# EAGLE design boost-highpower (EAGLE 9.6.0)
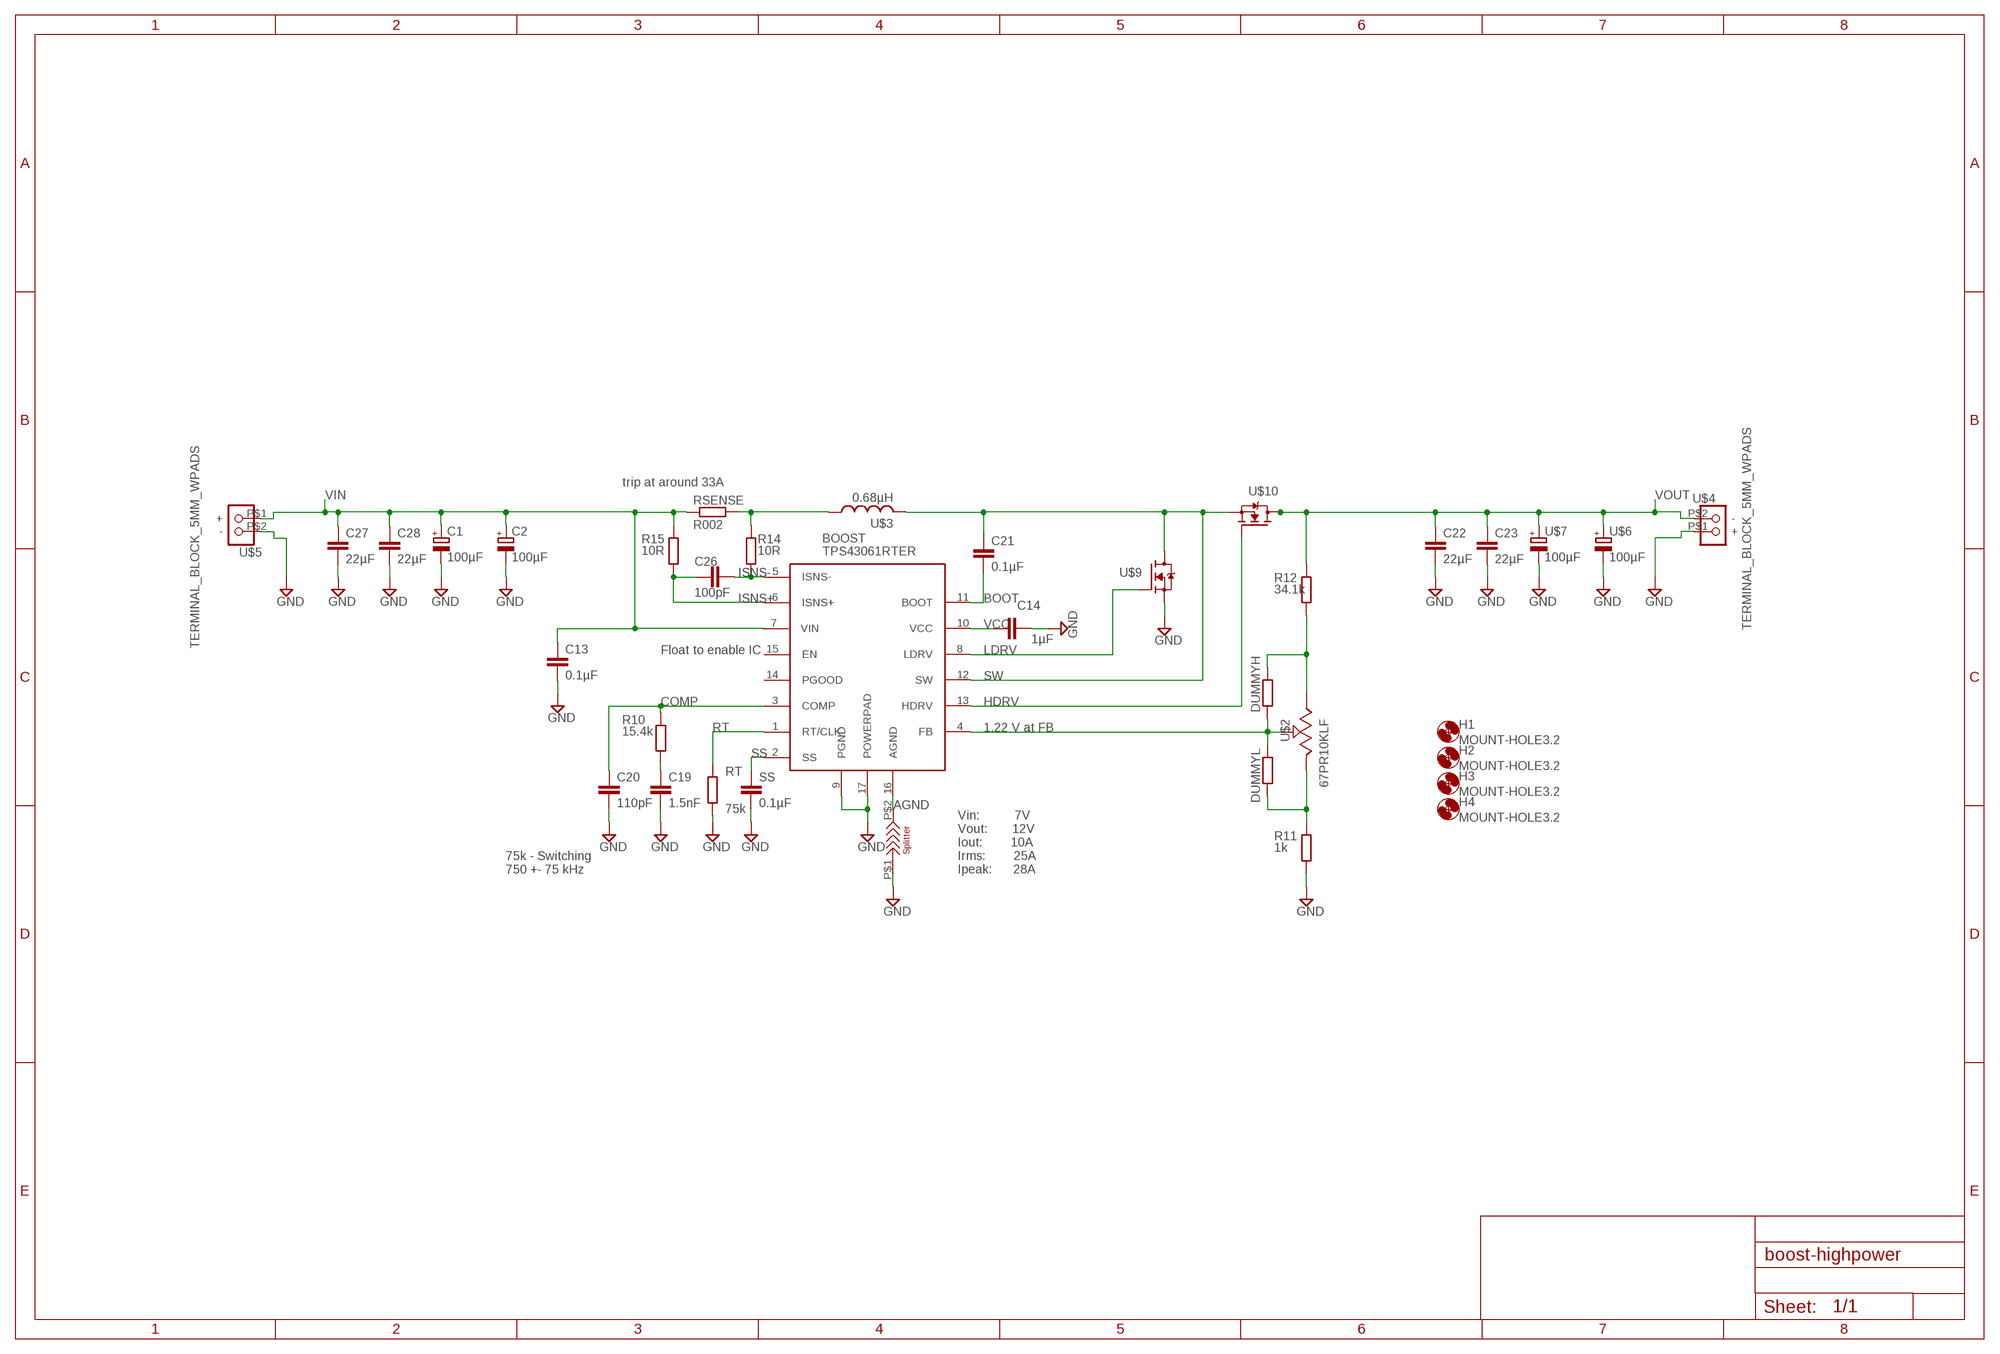
[diagram p0: schematic, sheet 1]

## Parts
BOOST  TPS43061RTER  [QFN50P300X300X80-17N]
C1  100µF  WCAP-ASLL-WE50V100µF  [CAPAE830X850N]
C2  100µF  WCAP-ASLL-WE50V100µF  [CAPAE830X850N]
C13  0.1µF  C-EUC0805  [C0805]
C14  1µF  C-EUC0603  [C0603]
C19  1.5nF  C-EUC0603  [C0603]
C20  110pF  C-EUC0603  [C0603]
C21  0.1µF  C-EUC0805  [C0805]
C22  22µF  C-EUC0805  [C0805]
C23  22µF  C-EUC0805  [C0805]
C26  100pF  C-EUC0603  [C0603]
C27  22µF  C-EUC0805  [C0805]
C28  22µF  C-EUC0805  [C0805]
DUMMYH  R-EU_R0201  [R0201]
DUMMYL  R-EU_R0201  [R0201]
H1  MOUNT-HOLE3.2  [3,2]
H2  MOUNT-HOLE3.2  [3,2]
H3  MOUNT-HOLE3.2  [3,2]
H4  MOUNT-HOLE3.2  [3,2]
R10  15.4k  R-EU_R0603  [R0603]
R11  1k  R-EU_R0603  [R0603]
R12  34.1k  R-EU_R0603  [R0603]
R14  10R  R-EU_R0603  [R0603]
R15  10R  R-EU_R0603  [R0603]
RSENSE  R002  R-EU_R2512W  [R2512W]
RT  75k  R-EU_R0603  [R0603]
SS  0.1µF  C-EUC0603  [C0603]
U$1  SPLITTER  [SPLITTER]
U$2  67PR10KLF  [67PR10KLF]
U$3  0.68µH  SRP1238A-XXXX  [INDM135125X330N]
U$4  TERMINAL_BLOCK_5MM_WPADS  [TERMINAL_5MM_WITH_SOLDERPADS]
U$5  TERMINAL_BLOCK_5MM_WPADS  [TERMINAL_5MM_WITH_SOLDERPADS]
U$6  100µF  CAP_VZH  [CAPAE1030X1000N]
U$7  100µF  CAP_VZH  [CAPAE1030X1000N]
U$9  CSD17301Q5A  [Q5A]
U$10  CSD17301Q5A  [Q5A]

## Nets
AGND: BOOST.16(AGND) U$1.P$2
BOOT: BOOST.11(BOOT) C21.2
COMP: BOOST.3(COMP) C20.1 R10.2
GND: BOOST.9(PGND) BOOST.17(POWERPAD) C1.2(-) C2.2(-) C13.2 C14.2 C19.2 C20.2 C22.2 C23.2 C27.2 C28.2 R11.1 RT.1 SS.2 U$1.P$1 U$4.P$1(+) U$5.P$2(-) U$6.2(-) U$7.2(-) U$9.1(S) U$9.2(S) U$9.3(S)
HDRV: BOOST.13(HDRV) U$10.4(G)
ISNS+: BOOST.6(ISNS+) C26.1 R15.1
ISNS-: BOOST.5(ISNS-) C26.2 R14.1
LDRV: BOOST.8(LDRV) U$9.4(G)
N$3: DUMMYH.2 R12.1 U$2.P$3
N$4: DUMMYL.1 R11.2 U$2.P$1
N$13: C19.1 R10.1
N$18: R14.2 RSENSE.2 U$3.1
N$20: BOOST.4(FB) DUMMYH.1 DUMMYL.2 U$2.P$2
RT: BOOST.1(RT/CLK) RT.2
SS: BOOST.2(SS) SS.1
SW: BOOST.12(SW) C21.1 U$3.2 U$9.5(D) U$9.6(D) U$9.7(D) U$9.8(D) U$9.9(D) U$10.1(S) U$10.2(S) U$10.3(S)
VCC: BOOST.10(VCC) C14.1
VIN: BOOST.7(VIN) C1.1(+) C2.1(+) C13.1 C27.1 C28.1 R15.2 RSENSE.1 U$5.P$1(+)
VOUT: C22.1 C23.1 R12.2 U$4.P$2(-) U$6.1(+) U$7.1(+) U$10.5(D) U$10.6(D) U$10.7(D) U$10.8(D) U$10.9(D)
Unconnected: BOOST.14(PGOOD) BOOST.15(EN)

## Notes on the sheet
- trip at around 33A
- Float to enable IC
- 1.22 V at FB
- 75k - Switching 
  750 +- 75 kHz
- Vin:          7V
  Vout:       12V
  Iout:        10A
  Irms:        25A
  Ipeak:      28A

## Library data of the parts
BOOST = PowerManagement:TPS43061RTER: Low Iq, Synchronous Boost Controller with Wide Input Voltage and 5.5V Gate Drive for Low Qg NexFETs Source: Datasheet <http://www.ti.com/lit/gpn/tps43061>; DESCRIPTION: Low Iq, Synchronous Boost Controller with Wide Input Voltage and 5.5V Gate Drive for Low Qg NexFETs; HEIGHT: 0.8mm; MANUFACTURER_NAME: Texas Instruments; MANUFACTURER_PART_NUMBER: TPS43061RTER; MOUSER_PART_NUMBER: 595-TPS43061RTER; MOUSER_PRICE-STOCK: https://www.mouser.com/Search/Refine.aspx?Keyword=595-TPS43061RTER
C1 C2 = Passive:WCAP-ASLL-WE
C13 C14 C19-C23 C26-C28 SS = rcl:C-EU: CAPACITOR, European symbol; SPICEPREFIX: C
DUMMYH DUMMYL R10-R12 R14 R15 RSENSE RT = rcl:R-EU_: RESISTOR, European symbol; SPICEPREFIX: R
H1-H4 = holes:MOUNT-HOLE: MOUNTING HOLE with drill center marker
U$1 = PowerManagement:SPLITTER
U$2 = Passive:67PR10KLF
U$3 = PowerManagement:SRP1238A-XXXX: Inductor Description: R68M: 0.68µH + 28A + 49Asat Source: Datasheet <https://www.mouser.se/datasheet/2/54/bourns_SRP1238A-1159514.pdf>
U$4 U$5 = Connectors:TERMINAL_BLOCK_5MM_WPADS
U$6 U$7 = Passive:CAP_VZH
U$9 U$10 = PowerManagement:CSD17301Q5A: CSD17301Q5A 30V N-channel 100A Mosfet Datasheet <http://www.ti.com/lit/ds/symlink/csd17301q5a.pdf> Part number Mfr:CSD17301Q5A Mouser: 595-CSD17301Q5A

## Board
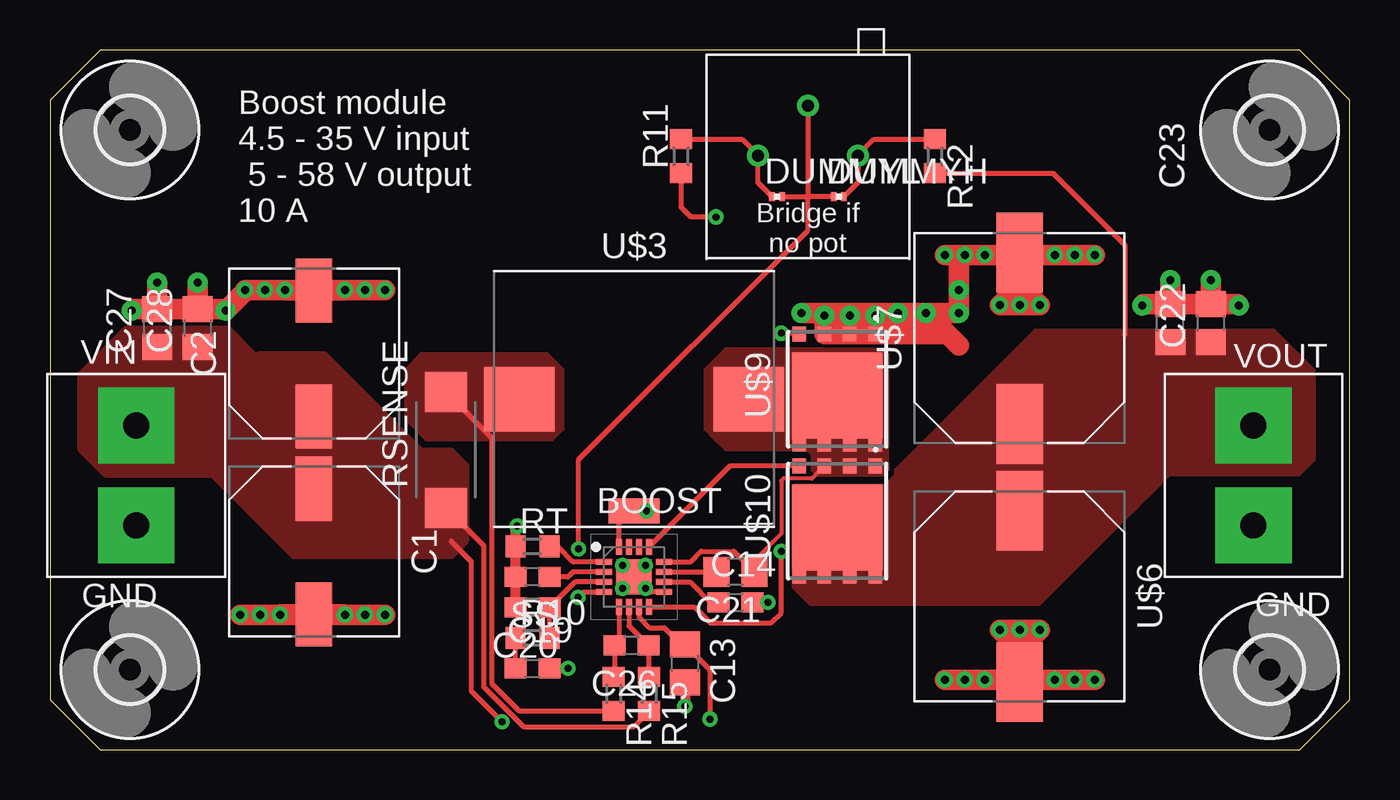
[diagram p1: board, top side]
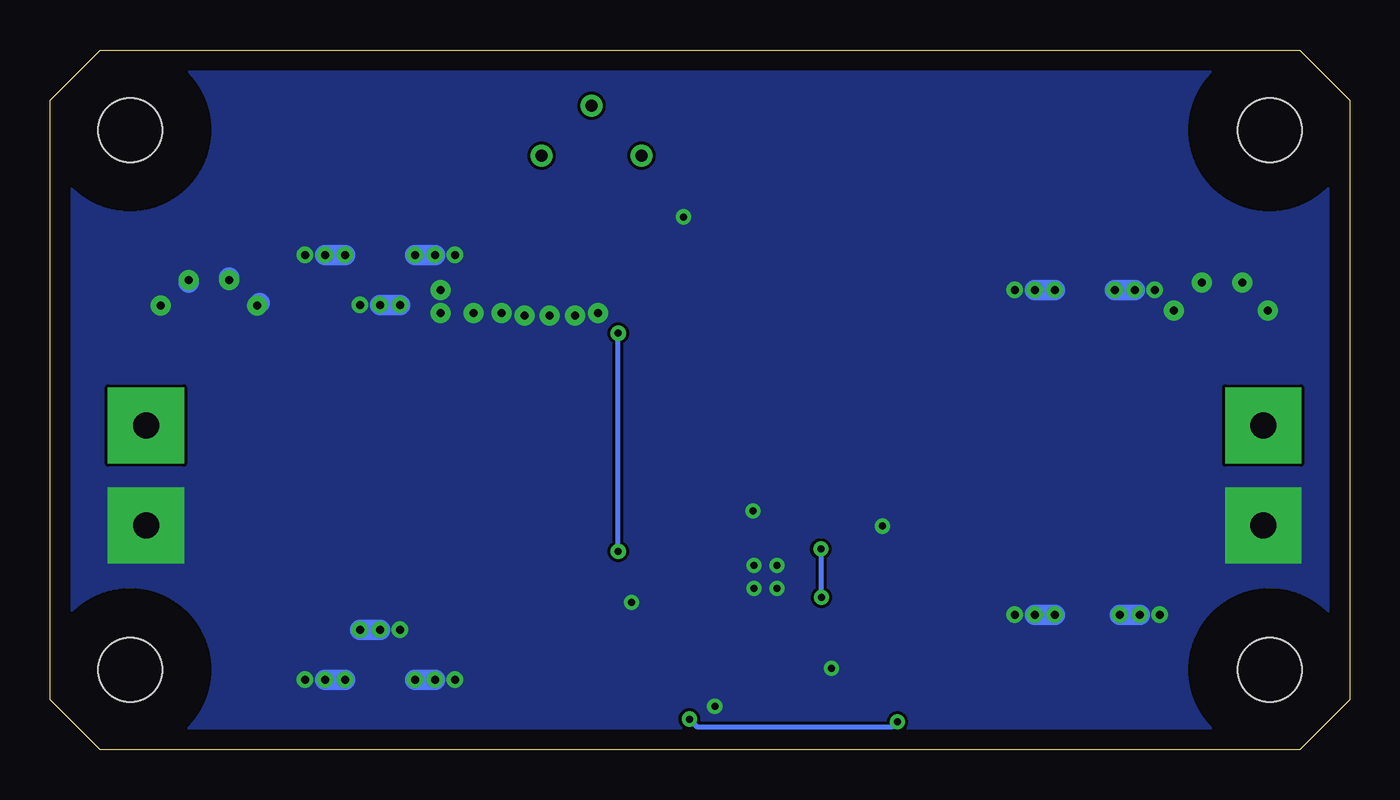
[diagram p2: board, bottom side, seen from below]

Size 65 x 35 mm. Coordinates in mm from the lower left corner, seen from the top.
Outline: 0,32.5 0,2.5 2.5,0 62.5,0 65,2.5 65,32.5 62.5,35 2.5,35 0,32.5
Copper layers (1*16): Top 0.035mm / dielectric 1.5mm / Bottom 0.035mm
Design rules "default": minimum track width 6mil, minimum drill 0.35mm, track to track 6mil, track to pad 6mil, pad to pad 6mil, via to via 6mil, smd to smd 6mil, copper to edge 40mil, drill to drill 6mil, minimum pad ring 10mil, minimum via ring 8mil, stop-mask expansion 4mil, vias tented up to drill 0mil, thermal gap 10mil

### Footprints (pad centres in the part's own frame; a part is rotated, then mirrored left to right if it is on the bottom)
QFN50P300X300X80-17N = smd 0.8 x 0.3: 1 -1.5,0.75; 2 -1.5,0.25; 3 -1.5,-0.25; 4 -1.5,-0.75; 9 1.5,-0.75; 10 1.5,-0.25; 11 1.5,0.25; 12 1.5,0.75 | smd 0.3 x 0.8: 5 -0.75,-1.5; 6 -0.25,-1.5; 7 0.25,-1.5; 8 0.75,-1.5; 13 0.75,1.5; 14 0.25,1.5; 15 -0.25,1.5; 16 -0.75,1.5 | smd 1.76 x 1.76: 17 0,0
CAPAE830X850N = smd 3.203 x 1.829: 1 -3.144,0; 2 3.144,0
C0805 = smd 1.3 x 1.5: 1 -0.95,0; 2 0.95,0
C0603 = smd 1.1 x 1: 1 -0.85,0; 2 0.85,0
R0201 = smd 0.28 x 0.43: 1 -0.255,0; 2 0.255,0
3,2 = hole 3.2: 0,0
R0603 = smd 1 x 1.1: 1 -0.85,0; 2 0.85,0
R2512W = smd 2 x 2.1: 1 -2.896,0; 2 2.896,0
SPLITTER = smd 1.27 x 1.27: P$1 0,0.635; P$2 0,-0.635
67PR10KLF = drill 0.6: P$1 2.5,-2.5; P$2 0,0; P$3 2.5,2.5
INDM135125X330N = smd 3.533 x 3.21: 1 -5.736,0; 2 5.736,0
TERMINAL_5MM_WITH_SOLDERPADS = drill 1.3 pad 3.81 square: P$1 0,2.5; P$2 0,-2.5
CAPAE1030X1000N = smd 3.991 x 2.31: 1 -4.288,0; 2 4.288,0
Q5A = smd 0.75 x 0.675: 1 2.752,-1.905; 2 2.752,-0.635; 3 2.752,0.635; 4 2.752,1.905 | smd 0.655 x 0.675: 5 -2.8,1.905; 6 -2.8,0.635; 7 -2.8,-0.635; 8 -2.8,-1.893 | smd 4.295 x 4.51: 9 -0.325,0

### Placement (x,y rotation side)
BOOST  29.21,8.64 0 top
C1  13.21,9.91 270 top
C2  13.21,19.81 90 top
C13  31.75,4.32 270 top
C14  34.29,7.37 0 top
C19  24.13,4.06 0 top
C20  24.13,7.11 180 top
C21  34.29,8.89 180 top
C22  58.07,21.33 90 top
C23  56.03,21.33 90 top
C26  29.08,5.21 180 top
C27  5.37,21.08 90 top
C28  7.4,21.08 90 top
DUMMYH  39.45,27.66 0 top
DUMMYL  36.37,27.66 0 top
H1  4,31 0 top
H2  4,4 0 top
H3  61,4 0 top
H4  61,31 0 top
R10  24.13,5.59 0 top
R11  31.56,29.68 90 top
R12  44.26,29.68 270 top
R14  28.19,2.79 270 top
R15  29.97,2.79 270 top
RSENSE  19.8,14.99 90 top
RT  24.13,10.16 0 top
SS  24.13,8.64 180 top
U$1  29.21,11.94 270 top
U$2  37.91,32.22 270 top
U$3  29.21,17.53 0 top
U$4  60.2,13.72 180 top
U$5  4.32,13.72 0 top
U$6  48.5,7.66 270 top
U$7  48.5,20.58 90 top
U$9  39.37,18.03 90 top
U$10  39.37,11.43 90 top

### Tracks (layer width: path | path; a pad name or v marks a point on that pad's centre or on a via)
AGND
  Top 0.254: BOOST.16 28.46,11.82 U$1.P$2
BOOT
  Top 0.254: BOOST.11 C21.2
COMP
  Top 0.254: BOOST.3 26.25,8.38 C20.1 R10.2
GND  (via drill 0.35 pad 0.6, 0.4, 0.4 pad 1)
  Top 0.254: BOOST.9 29.73,7.89 29.72,7.87 28.45,7.87 28.45,8.64 | 28.45,8.64 28.45,9.4 29.97,9.4 29.97,7.87 | BOOST.17 28.45,8.64 | BOOST.17 v28.64,9.21 | BOOST.17 v29.78,9.21 | BOOST.17 v29.78,8.07 | BOOST.17 v28.64,8.07 | C14.2 v35.92,7.37 | v33.31,26.65 32.06,26.65 31.56,27.15 R11.1
  Top 0.508: C20.2 SS.2 RT.1 23.28,11.09 v23.37,11.18 | C19.2 v25.91,4.06 | C13.2 v31.75,2.16
  Top 1.016: C27.2 C28.2 | C28.2 8.73,22.03 v8.79,21.97 9.75,22.93 v9.75,23 | C27.2 4.16,22.03 v4.1,21.97 | C27.2 v5.37,23.37 | C28.2 v7.4,23.37 | U$9.3 U$9.1 | U$9.3 v38.73,21.72 | 40.01,21.34 U$9.2 40.94,21.72 v41.27,21.72 | 40.01,21.34 v40.01,21.72 | U$9.1 v41.27,21.72 | v41.27,21.72 42.29,21.72 | 42.29,21.72 v42.42,21.84 43.18,21.84 | v37.59,21.84 42.16,21.84 42.29,21.72 | U$9.3 39.28,21.34 40.01,21.34 | 43.22,20.79 U$9.1 | 45.47,20.2 v43.82,21.84 | 44.63,20.79 43.69,20.79 | 43.69,20.79 43.22,20.79 | 43.22,20.79 42.67,21.34 43.18,21.84 | 43.18,21.84 v43.82,21.84 | C22.2 59.4,22.28 v59.46,22.22 | C23.2 54.7,22.28 v54.64,22.22 | C23.2 v56.03,23.49 | C22.2 v58.07,23.49 | C22.2 C23.2 | v43.82,21.84 v45.47,21.84 v45.47,22.99 45.47,24.47 v45.75,24.75 v44.75,24.75 v52.25,24.75 v51.25,24.75 | v43.82,21.84 43.69,21.71 43.69,20.79 | 48.5,26.25 U$7.2 48.5,23.25 | v51.25,3.5 v52.25,3.5 v44.75,3.5 v45.75,3.5 | 48.5,5.25 v48.5,6 v47.5,6 | v47.5,6 v49.5,6 49,5.5 49,5 48.75,5 48.5,5.25 | 48.5,5.25 U$6.2 48.5,5 v47.5,6 | 48.5,23.25 v48.5,22.25 | 48.5,23.25 v47.5,22.25 v49.5,22.25 48.5,23.25 | v11.5,6.75 11.51,6.76 C1.2 14.74,6.76 v14.75,6.75 | v10.5,6.75 v9.5,6.75 v16.75,6.75 v15.75,6.75 | v14.75,23 14.71,22.96 C2.2 11.79,22.96 v11.75,23 | v15.75,23 v16.75,23 v9.75,23 | v10.75,23 v9.75,23
  Bottom 0.254: v35.92,7.37 36.07,7.37
  Bottom 1.016: v54.64,22.22 54.51,22.34 | v56.03,23.49 56.03,23.61 | v58.07,23.49 58.07,23.36 | v50.25,24.75 v51.25,24.75 | v46.75,24.75 v45.75,24.75 | v50.25,3.5 v51.25,3.5 | v46.75,3.5 v45.75,3.5 | v48.5,6 v49.5,6 | v48.5,22.25 v47.5,22.25 | v11.5,6.75 v10.5,6.75 | v14.75,6.75 v15.75,6.75 | v14.75,23 v15.75,23 | v11.75,23 v10.75,23
  other vias: 29.84,11.94
  pour Bottom (no thermals): 64.77,36.07 -0.25,36.07 -1.52,34.8 -1.52,1.52 1.27,-1.27 63.75,-1.27 67.06,2.03 67.06,33.78
HDRV
  Top 0.254: U$10.4 34.01,14.18 BOOST.13
ISNS+
  Top 0.254: BOOST.6 28.96,6.18 C26.1 29.93,3.68 R15.1
ISNS-
  Top 0.254: BOOST.5 28.46,5.43 C26.2 28.23,3.68 R14.1
LDRV  (via drill 0.35 pad 0.6)
  Top 0.254: BOOST.8 32.23,7.14 32.61,6.76 32.61,6.75 33.03,6.33 36.06,6.33 36.58,6.85 v36.58,9.91 | v36.58,20.83 37.42,20.83 U$9.4
  Bottom 0.254: v36.58,9.91 v36.58,20.83
N$3
  Top 0.254: DUMMYH.2 40.41,28.37 U$2.P$3 41.22,30.53 R12.1
N$4
  Top 0.254: R11.2 34.6,30.53 U$2.P$1 35.41,28.37 DUMMYL.1
N$13
  Top 0.254: C19.1 R10.1
N$18
  Top 0.254: RSENSE.2 22.1,15.59 22.1,3.3 23.46,1.94 R14.2
  pour Top (no thermals): 25.65,19.05 25.65,16 25.15,15.49 18.8,15.49 17.78,16.51 17.78,19.05 18.54,19.81 24.89,19.81
N$20  (via drill 0.35 pad 0.6)
  Top 0.254: BOOST.4 27.7,7.87 26.67,7.87 v26.42,7.62 | v26.45,10.04 26.45,14.51 37.91,25.97 37.91,27.75 | DUMMYH.1 38,27.66 | DUMMYL.2 38,27.66 | U$2.P$2 37.91,28 37.91,27.75 | 37.91,27.75 38,27.66
  Bottom 0.254: v26.42,7.62 26.42,10.01 v26.45,10.04
RT
  Top 0.254: BOOST.1 26.17,9.39 25.4,10.16 RT.2
SS
  Top 0.254: BOOST.2 26.16,8.89 25.91,8.64 SS.1
SW
  Top 0.203: U$10.3 38.11,13.55 36.67,13.55 36.58,13.46 36.58,10.8 35.24,9.46 C21.1
  Top 0.254: BOOST.12 30.72,9.4 32.05,9.4 32.57,9.92 34.21,9.92 C21.1
  pour Top (no thermals): 41.66,20.07 34.8,20.07 33.78,20.07 32.77,19.05 32.77,18.8 32.77,16 33.27,15.49 33.78,14.99 37.85,14.99 38.1,14.73 38.1,14.48 38.1,13.97 38.35,13.72 41.4,13.72 41.66,13.72 41.91,13.97 41.91,19.81
VCC
  Top 0.254: BOOST.10 32,8.39 33.02,7.37 C14.1
VIN  (via drill 0.35 pad 0.6)
  Top 0.254: RSENSE.1 21.69,10.2 21.69,3.13 23.68,1.14 29.21,1.14 29.97,1.91 R15.2 | BOOST.7 29.46,6.6 29.97,6.1 30.73,6.1 31.56,5.27 C13.1 33.02,4 v33.02,1.52 | v22.61,1.39 21.08,2.92 21.08,9.4 20.07,10.41
  Bottom 0.254: v33.02,1.52 32.64,1.14 22.86,1.14 v22.61,1.39
  pour Top (no thermals): 1.52,18.8 3.81,21.08 8.91,21.08 10.41,19.57 10.41,19.8 13.72,19.8 18.54,14.99 20.07,14.99 20.83,14.22 20.83,10.41 20.05,9.64 12.21,9.64 8.13,13.72 2.79,13.72 1.52,14.99
VOUT
  Top 0.254: R12.2 50.17,28.83 53.75,25.25 53.75,20.75
  pour Top (no thermals): 56,13.75 62.5,13.75 63.25,14.5 63.25,19 61.25,21 49.25,21 42.25,14 42.25,13.75 41.75,13.25 37.25,13.25 37.13,13.13 37.13,8.12 38,7.25 49.5,7.25

### Text on the board
tDocu: .
bDocu: Boost module / TPS43061 / Oskar Johansson / 2020-03-31 Rev 2
_tNames: Boost module / 4.5 - 35 V input / 5 - 58 V output / 10 A | Bridge if / no pot | VIN | VOUT | GND | GND